# EAGLE design main (EAGLE 8.2.2)
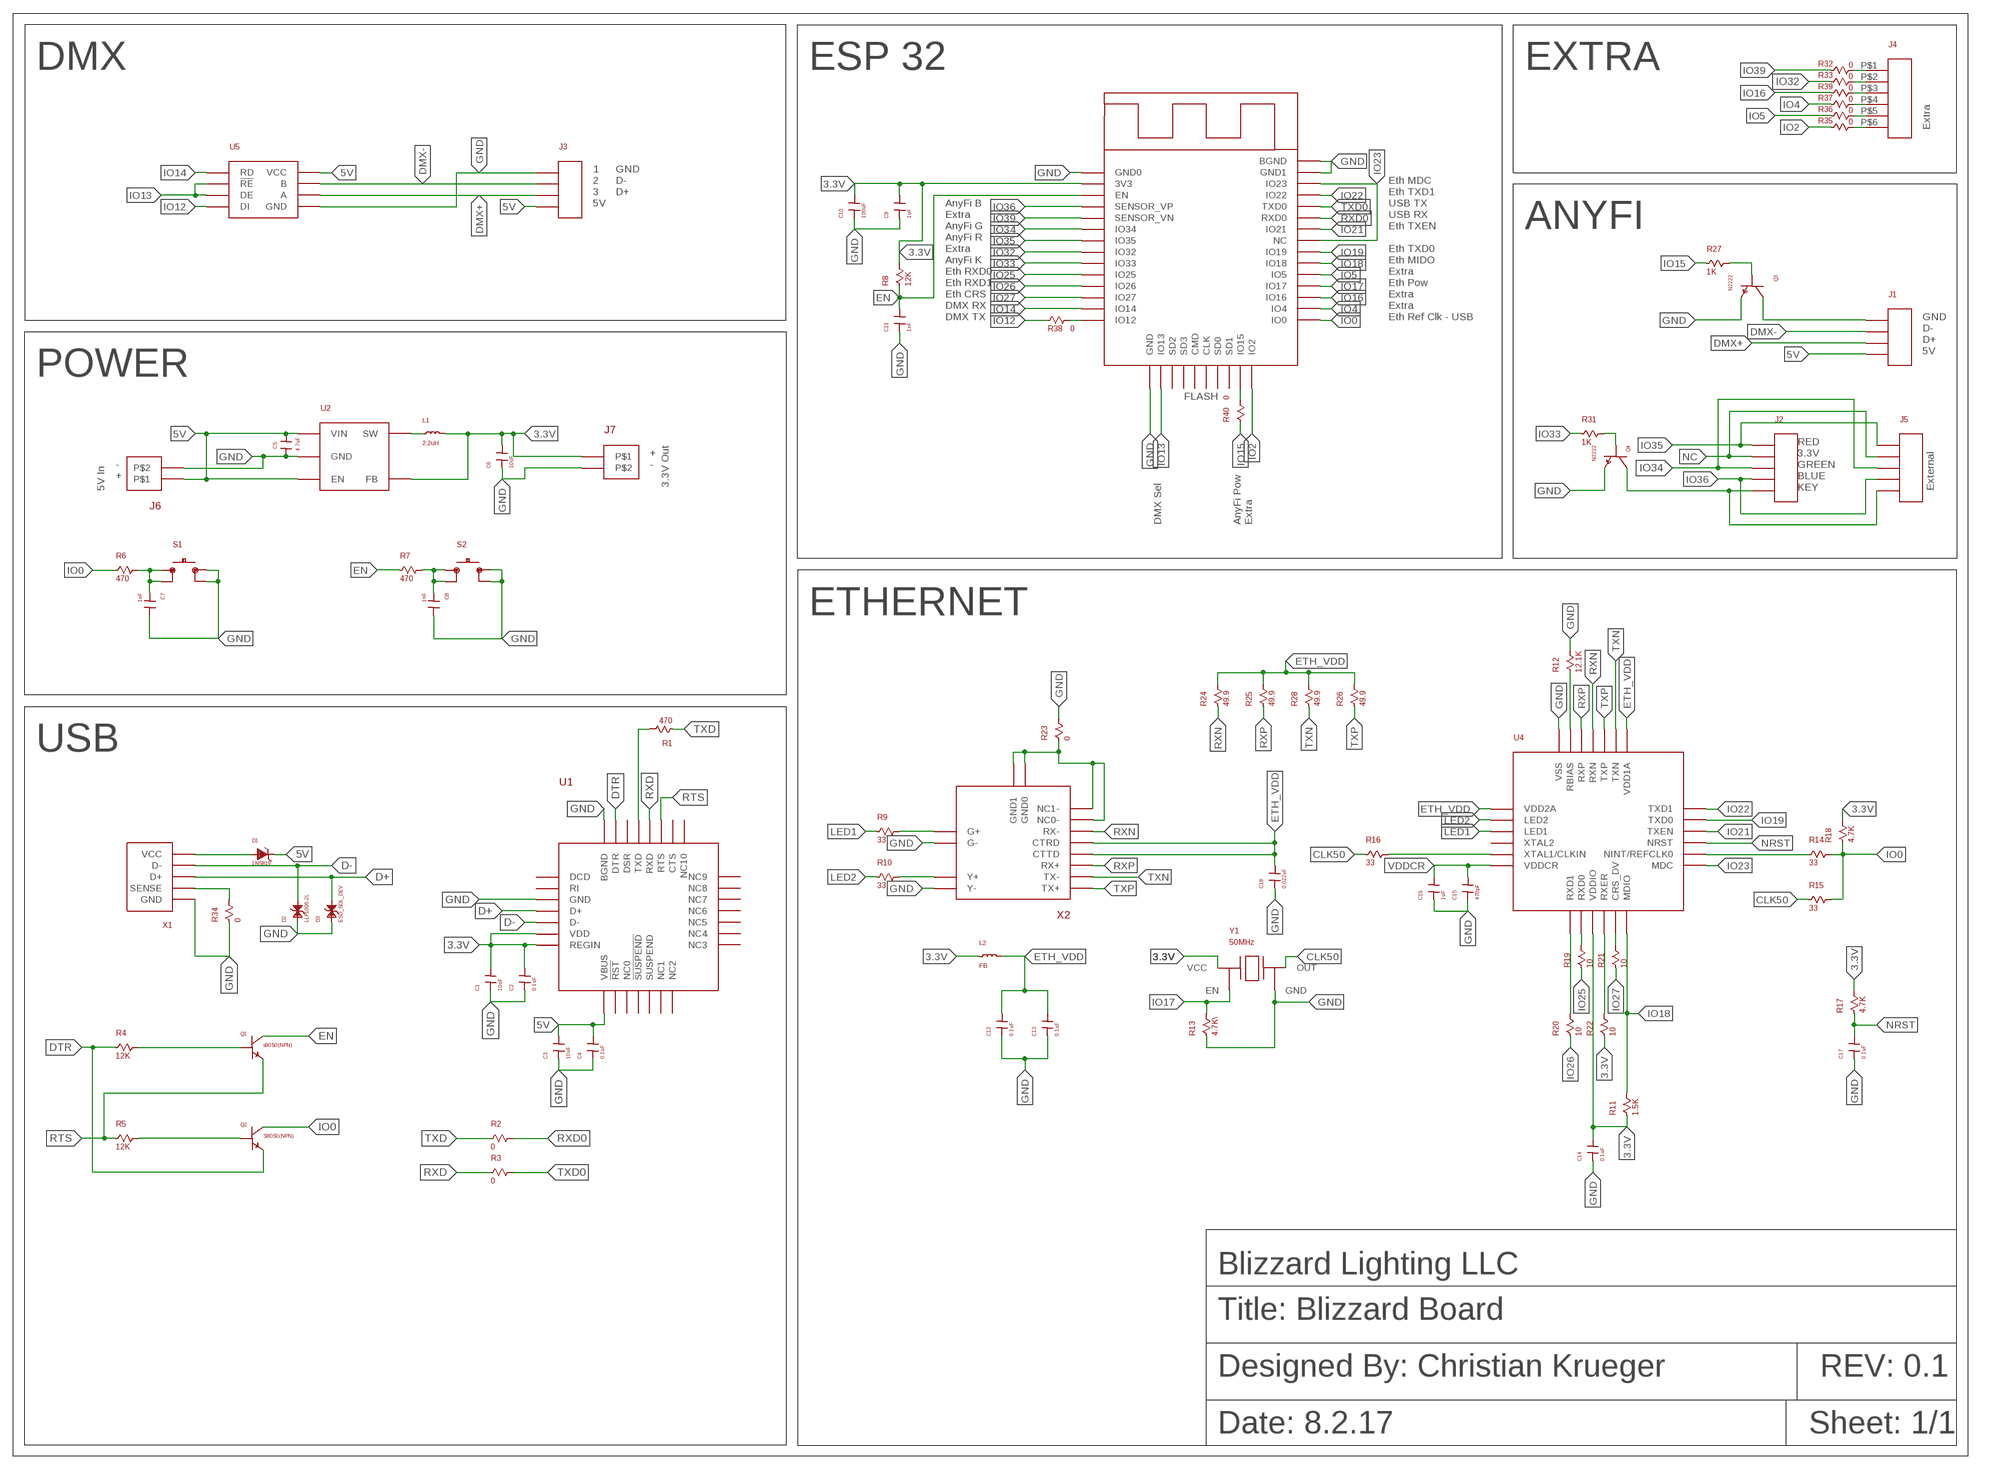
[diagram p0: schematic, sheet 1]

## Parts
C1  10uF  0805_CAP_DEV  [0805_PKG]
C2  0.1uF  0805_CAP_DEV  [0805_PKG]
C3  10uF  0805_CAP_DEV  [0805_PKG]
C4  0.1uF  0805_CAP_DEV  [0805_PKG]
C5  4.7uF  0805_CAP_DEV  [0805_PKG]
C6  10uF  0805_CAP_DEV  [0805_PKG]
C7  1nF  0805_CAP_DEV  [0805_PKG]
C8  1nF  0805_CAP_DEV  [0805_PKG]
C9  1uF  0805_CAP_DEV  [0805_PKG]
C10  100uF  0805_CAP_DEV  [0805_PKG]
C11  1nF  0805_CAP_DEV  [0805_PKG]
C12  0.1uF  0805_CAP_DEV  [0805_PKG]
C13  0.1uF  0805_CAP_DEV  [0805_PKG]
C14  0.1uF  0805_CAP_DEV  [0805_PKG]
C15  470pF  0805_CAP_DEV  [0805_PKG]
C16  1uF  0805_CAP_DEV  [0805_PKG]
C17  0.1uF  0805_CAP_DEV  [0805_PKG]
C18  0.022uF  0805_CAP_DEV  [0805_PKG]
D1  1N5819  ZENER_DEV  [ZENER_PKG]
D2  LLP1006-2L  ESD_SOL_DEV  [ESD_SOL_PKG]
D3  ESD_SOL_DEV  [ESD_SOL_PKG]
J1  XH_4POS_DEV  [XH_4POS_PKG]
J2  XH_5POS_DEV  [XH_5POS_PKG]
J3  XH_4POS_DEV  [XH_4POS_PKG]
J4  XH_6POS_DEV  [XH_6POS_PKG]
J5  XH_5POS_DEV  [XH_5POS_PKG]
J6  XH_2POS_DEV  [XH_2POS_PKG]
J7  XH_2POS_DEV  [XH_2POS_PKG]
L1  2.2uH  0805_IND_DEV  [0805_PKG]
L2  FB  0805_IND_DEV  [0805_PKG]
Q1  s8050(NPN)  NPN_1.5A_40V_DEV  [SOT_23_3_PKG]
Q2  S8050(NPN)  NPN_1.5A_40V_DEV  [SOT_23_3_PKG]
Q3  N2222  NPN_N2222_DEV  [SOT_23_3_PKG]
Q4  N2222  NPN_N2222_DEV  [SOT_23_3_PKG]
R1  470  0805_RES_DEV  [0805_PKG]
R2  0  0805_RES_DEV  [0805_PKG]
R3  0  0805_RES_DEV  [0805_PKG]
R4  12K  0805_RES_DEV  [0805_PKG]
R5  12K  0805_RES_DEV  [0805_PKG]
R6  470  0805_RES_DEV  [0805_PKG]
R7  470  0805_RES_DEV  [0805_PKG]
R8  12K  0805_RES_DEV  [0805_PKG]
R9  33  0805_RES_DEV  [0805_PKG]
R10  33  0805_RES_DEV  [0805_PKG]
R11  1.5K  0805_RES_DEV  [0805_PKG]
R12  12.1K  0805_RES_DEV  [0805_PKG]
R13  4.7K\  0805_RES_DEV  [0805_PKG]
R14  33  0805_RES_DEV  [0805_PKG]
R15  33  0805_RES_DEV  [0805_PKG]
R16  33  0805_RES_DEV  [0805_PKG]
R17  4.7K  0805_RES_DEV  [0805_PKG]
R18  4.7K  0805_RES_DEV  [0805_PKG]
R19  10  0805_RES_DEV  [0805_PKG]
R20  10  0805_RES_DEV  [0805_PKG]
R21  10  0805_RES_DEV  [0805_PKG]
R22  10  0805_RES_DEV  [0805_PKG]
R23  0  0805_RES_DEV  [0805_PKG]
R24  49.9  0805_RES_DEV  [0805_PKG]
R25  49.9  0805_RES_DEV  [0805_PKG]
R26  49.9  0805_RES_DEV  [0805_PKG]
R27  1K  0805_RES_DEV  [0805_PKG]
R28  49.9  0805_RES_DEV  [0805_PKG]
R31  1K  0805_RES_DEV  [0805_PKG]
R32  0  0805_RES_DEV  [0805_PKG]
R33  0  0805_RES_DEV  [0805_PKG]
R34  0  0805_RES_DEV  [0805_PKG]
R35  0  0805_RES_DEV  [0805_PKG]
R36  0  0805_RES_DEV  [0805_PKG]
R37  0  0805_RES_DEV  [0805_PKG]
R38  0  0805_RES_DEV  [0805_PKG]
R39  0  0805_RES_DEV  [0805_PKG]
R40  0  0805_RES_DEV  [0805_PKG]
S1  TACTILE_PB_DEV  [TACKTILE_PB_PKG]
S2  TACTILE_PB_DEV  [TACKTILE_PB_PKG]
U1  USB_TO_UART_DEV  [QFN_28_PKG]
U2  BUCK_CONVERTER_DEV  [SOT_23_PKG]
U3  ESP_WROOM_32_DEV  [ESP_WROOM_32_PKG]
U4  LAN8720_DEV  [QFN_24_PKG]
U5  MAX_485_DEV  [MAX_485_PKG]
X1  USB_CONN_DEV  [USB_CONN_PKG]
X2  ETHERNET_DEV  [ETHERNET_PKG]
Y1  50MHz  OSC_DEV  [OSC_PKG]

## Nets
3.3V: C1.P$2 C2.P$2 C6.P$2 C9.P$2 C10.P$2 C14.P$2 J7.P$1 L1.P$2 L2.P$1 R8.P$2 R11.P$1 R17.P$2 R18.P$2 R22.P$1 U1.REGIN U1.VDD U2.4(FB) U3.3V3 U4.9(VDDIO) Y1.4(VCC)
5V: C3.P$2 C4.P$2 C5.P$2 D1.P$2 J1.P$4 J3.P$4 J6.P$1 U1.VBUS U2.1(VIN) U2.3(EN) U5.P$8(VCC)
CLK50: R15.P$1 R16.P$1 Y1.3(OUT)
D+: D3.P$2 U1.D+ X1.PIN3(D+)
D-: D2.P$2 U1.D- X1.PIN2(D-)
DMX+: J1.P$3 J3.P$3 U5.P$6(A)
DMX-: J1.P$2 J3.P$2 U5.P$7(B)
DTR: Q2.P$2(E) R4.P$1 U1.DTR
EN: C11.P$2 Q1.P$3(C) R7.P$1 R8.P$1 U3.EN
ETH_VDD: C12.P$2 C13.P$2 C18.P$2 L2.P$2 R24.P$2 R25.P$2 R26.P$2 R28.P$2 U4.1(VDD2A) U4.19(VDD1A) X2.4(CTTD) X2.5(CTRD)
GND: C1.P$1 C2.P$1 C3.P$1 C4.P$1 C5.P$1 C6.P$1 C7.P$2 C8.P$2 C9.P$1 C10.P$1 C11.P$1 C12.P$1 C13.P$1 C14.P$1 C15.P$1 C16.P$1 C17.P$1 C18.P$1 D2.P$1 D3.P$1 J3.P$1 J6.P$2 J7.P$2 Q3.P$2(E) Q4.P$2(E) R12.P$2 R13.P$1 R23.P$2 R34.P$2 S1.3 S1.4 S2.3 S2.4 U1.BGND U1.GND U2.2(GND) U3.BGND U3.GND0(GND) U3.GND1(GND0) U3.GND2(GND1) U4.BGND(VSS) U5.P$5(GND) X1.PIN4(SENSE) X2.G- X2.Y- Y1.2(GND)
IO0: Q2.P$3(C) R6.P$1 R14.P$2 R15.P$2 R18.P$1 U3.IO0
IO2: R35.P$1 U3.IO2
IO4: R37.P$1 U3.IO4
IO5: R36.P$1 U3.IO5
IO12: R38.P$1 U5.P$4(DI)
IO13: U3.IO13 U5.P$2(!RE) U5.P$3(DE)
IO14: U3.IO14 U5.P$1(RD)
IO15: R27.P$1 R40.P$1
IO16: R39.P$1 U3.IO16
IO17: R13.P$2 U3.IO17 Y1.1(EN)
IO18: R11.P$2 U3.IO18 U4.12(MDIO)
IO19: U3.IO19 U4.17(TXD0)
IO21: U3.IO21 U4.16(TXEN)
IO22: U3.IO22 U4.18(TXD1)
IO23: U3.IO23 U3.NC U4.13(MDC)
IO25: R19.P$1 U3.IO25
IO26: R20.P$1 U3.IO26
IO27: R21.P$1 U3.IO27
IO32: R33.P$1 U3.IO32
IO33: R31.P$1 U3.IO33
IO34: J2.P$3 J5.P$3 U3.IO34
IO35: J2.P$1 J5.P$1 U3.IO35
IO36: J2.P$4 J5.P$4 U3.SENSOR_VP
IO39: R32.P$1 U3.SENSOR_VN
LED1: R9.P$1 U4.3(LED1)
LED2: R10.P$1 U4.2(LED2)
N$1: J4.P$1 R32.P$2
N$2: J4.P$2 R33.P$2
N$3: R1.P$2 U1.TXD
N$4: D1.P$1 X1.PIN1(VCC)
N$5: Q1.P$1(B) R4.P$2
N$6: Q2.P$1(B) R5.P$2
N$7: L1.P$1 U2.5(SW)
N$8: R34.P$1 X1.PIN5(GND)
N$9: J4.P$3 R39.P$2
N$10: J4.P$4 R37.P$2
N$11: J4.P$5 R36.P$2
N$12: J4.P$6 R35.P$2
N$13: R38.P$2 U3.IO12
N$14: R40.P$2 U3.IO15
N$24: R9.P$2 X2.G+
N$25: C7.P$1 R6.P$2 S1.1 S1.2
N$26: R22.P$2 U4.10(RXER)
N$28: R10.P$2 X2.Y+
N$29: C8.P$1 R7.P$2 S2.1 S2.2
N$30: R12.P$1 U4.24(RBIAS)
N$32: R16.P$2 U4.5(XTAL1/CLKIN)
N$33: R14.P$1 U4.14(NINT/REFCLK0)
N$34: R20.P$2 U4.7(RXD1)
N$35: R19.P$2 U4.8(RXD0)
N$36: R21.P$2 U4.11(CRS_DV)
N$37: R23.P$1 X2.7(NC0-) X2.8(NC1-) X2.GND0 X2.GND1
N$38: J1.P$1 Q3.P$3(C)
N$41: J2.P$5 J5.P$5 Q4.P$3(C)
N$42: Q4.P$1(B) R31.P$2
N$53: Q3.P$1(B) R27.P$2
NC: J2.P$2 J5.P$2
NRST: C17.P$2 R17.P$1 U4.15(NRST)
RTS: Q1.P$2(E) R5.P$1 U1.RTS
RXD: R3.P$1 U1.RXD
RXD0: R2.P$2 U3.RXD0
RXN: R24.P$1 U4.22(RXN) X2.6(RX-)
RXP: R25.P$1 U4.23(RXP) X2.3(RX+)
TXD: R1.P$1 R2.P$1
TXD0: R3.P$2 U3.TXD0
TXN: R28.P$1 U4.20(TXN) X2.2(TX-)
TXP: R26.P$1 U4.21(TXP) X2.1(TX+)
VDDCR: C15.P$2 C16.P$2 U4.6(VDDCR)
Unconnected: U1.!RST U1.!SUSPEND U1.CTS U1.DCD U1.DSR U1.NC0 U1.NC1 U1.NC2 U1.NC3 U1.NC4 U1.NC5 U1.NC6 U1.NC7 U1.NC8 U1.NC9 U1.NC10 U1.RI U1.SUSPEND U3.CLK U3.CMD U3.SD0 U3.SD1 U3.SD2 U3.SD3 U4.4(XTAL2)

## Notes on the sheet
- DMX | ESP 32 | EXTRA
- Extra
- 1 | GND
- 2 | D- | Eth MDC
- 3 | D+ | Eth TXD1
- 5V | AnyFi B | USB TX
- Extra | USB RX
- AnyFi G | Eth TXEN | ANYFI
- AnyFi R
- Extra | Eth TXD0
- AnyFi K | Eth MIDO
- Eth RXD0 | Extra
- Eth RXD1 | Eth Pow
- Eth CRS | Extra
- DMX RX | Extra
- DMX TX | Eth Ref Clk - USB | GND
- D-
- D+
- 5V
- POWER
- FLASH
- 3.3V Out | RED
- + | 3.3V
- - | - | GREEN
- + | BLUE
- 5V In | KEY | External
- DMX Sel | AnyFi Pow | Extra
- ETHERNET
- USB
- Blizzard Lighting LLC
- Title: Blizzard Board
- Designed By: Christian Krueger | REV: 0.1
- Date: 8.2.17 | Sheet: 1/1

## Library data of the parts
C1-C18 = blizzard_common_1:0805_CAP_DEV
D1 = blizzard_common_1:ZENER_DEV
D2 D3 = blizzard_common_1:ESD_SOL_DEV
J1 J3 = blizzard_common_1:XH_4POS_DEV
J2 J5 = blizzard_common_1:XH_5POS_DEV
J4 = blizzard_common_1:XH_6POS_DEV
J6 J7 = blizzard_common_1:XH_2POS_DEV
L1 L2 = blizzard_common_1:0805_IND_DEV
Q1 Q2 = blizzard_common_0:NPN_1.5A_40V_DEV: • SOT-23 Plastic-Encapsulate Transistors • Capable of 0.3Watts(Tamb=25O C) of Power Dissipation. • Collector-current 1.5A • Collector-base Voltage 40V • Operating and storage junctio
Q3 Q4 = blizzard_common_0:NPN_N2222_DEV
R1-R28 R31-R40 = blizzard_common_1:0805_RES_DEV
S1 S2 = blizzard_common_1:TACTILE_PB_DEV
U1 = blizzard_board:USB_TO_UART_DEV: SINGLE-CHIP USB-TO-UART BRIDGE
U2 = blizzard_common_0:BUCK_CONVERTER_DEV: LM3671/-Q1 2-MHz, 600-mA Step-Down DC-DC Converter
U3 = blizzard_board:ESP_WROOM_32_DEV: ESP Wroom 32
U4 = blizzard_board:LAN8720_DEV: LAN8720A Ethernet
U5 = blizzard_board:MAX_485_DEV: MAX 485
X1 = blizzard_common_1:USB_CONN_DEV
X2 = blizzard_board:ETHERNET_DEV: Ethernet Jack
Y1 = blizzard_board:OSC_DEV

## Board
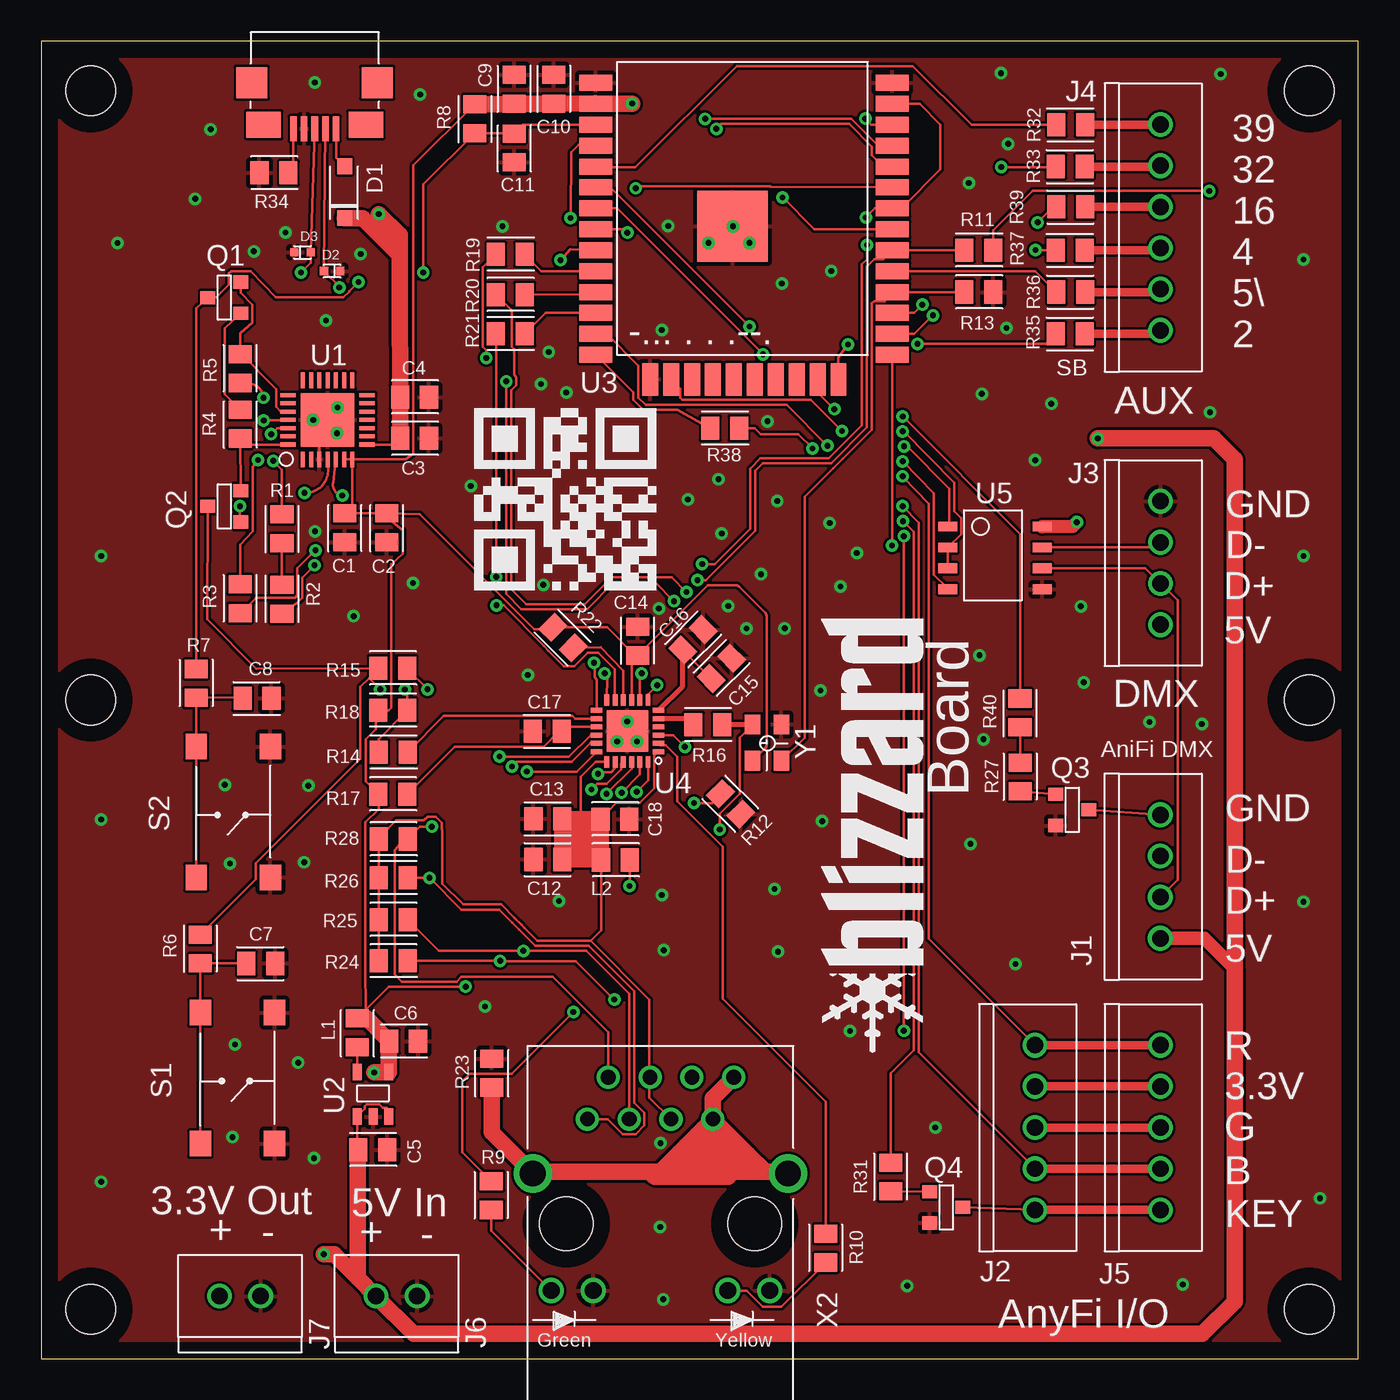
[diagram p1: board, top side]
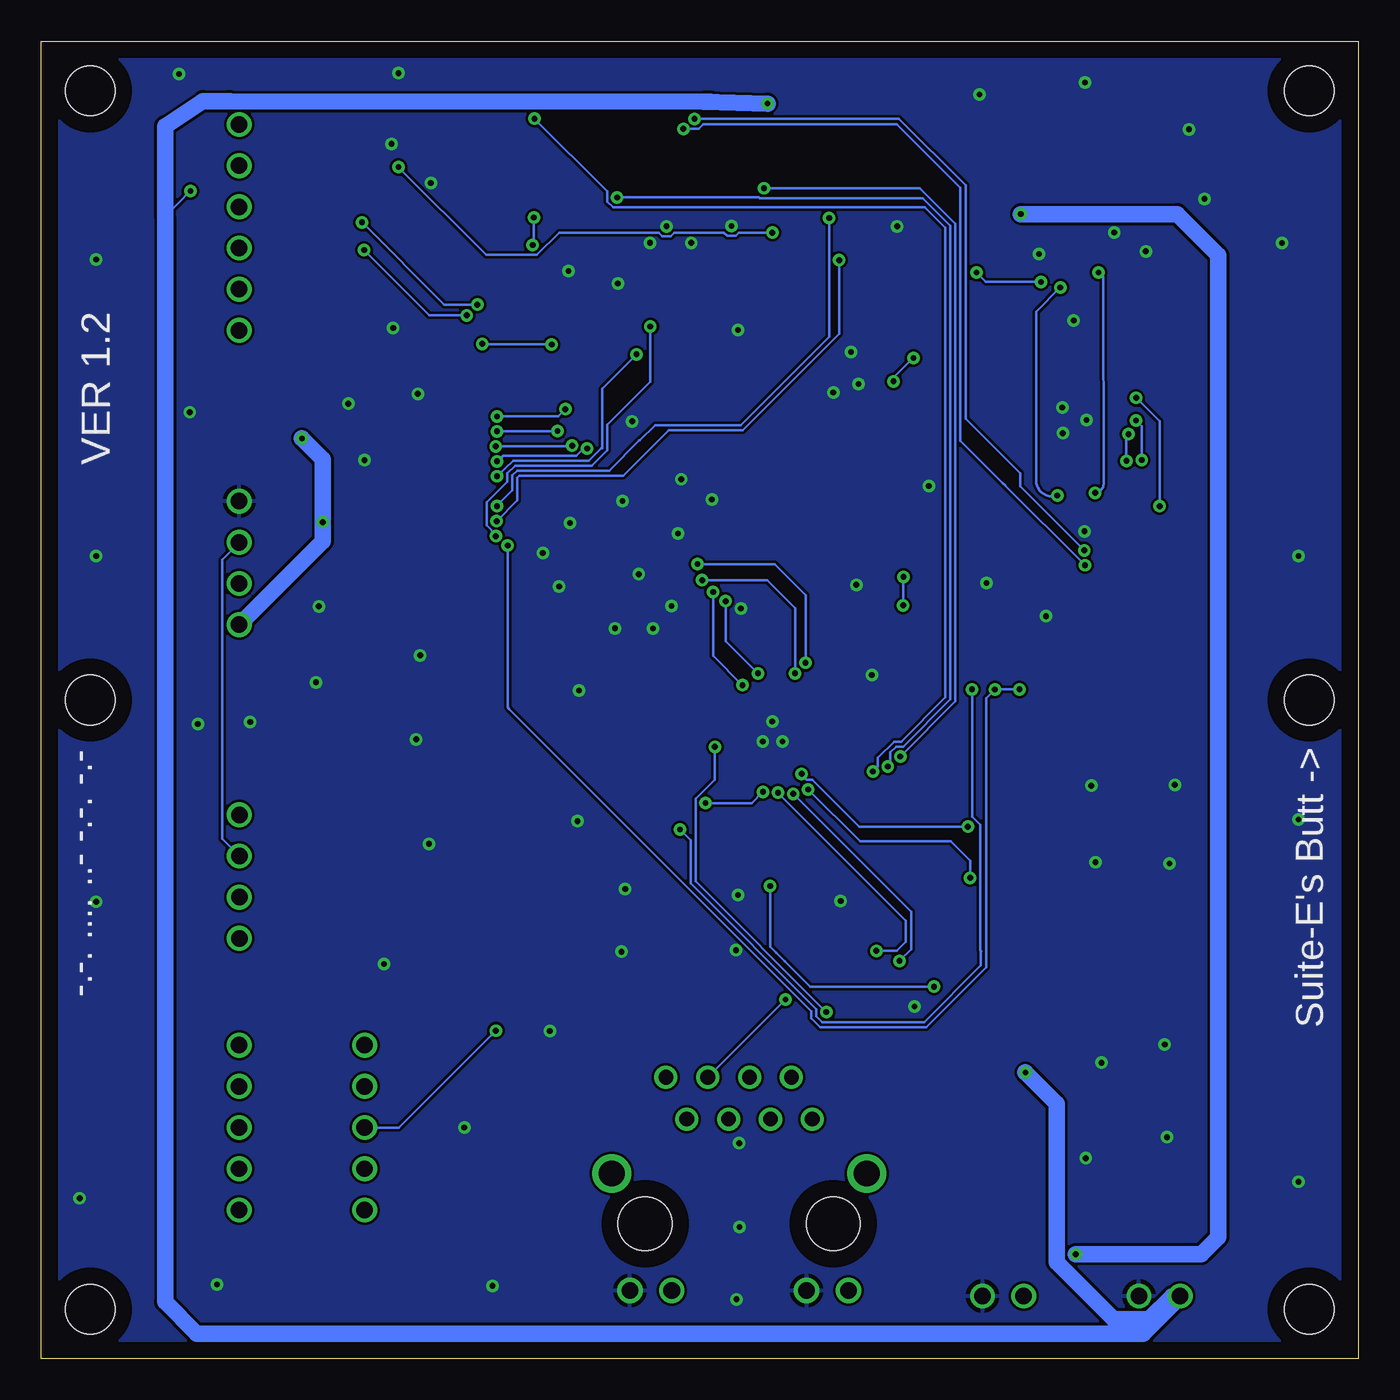
[diagram p2: board, bottom side, seen from below]

Size 79.98 x 80 mm. Coordinates in mm from the lower left corner, seen from the top.
Outline: 0,0 79.98,0 79.98,80 0,80 0,0
Copper layers (1*16): Top 0.035mm / dielectric 1.5mm / Bottom 0.035mm
Design rules "default": minimum track width 6mil, minimum drill 0.35mm, track to track 6mil, track to pad 6mil, pad to pad 6mil, via to via 6mil, smd to smd 6mil, copper to edge 40mil, drill to drill 6mil, minimum pad ring 10mil, minimum via ring 8mil, stop-mask expansion 4mil, vias tented up to drill 0mil, thermal gap 10mil
Holes 3 mm at 3,77 77,77 77,3 3,3 3,40 77,40

### Footprints (pad centres in the part's own frame; a part is rotated, then mirrored left to right if it is on the bottom)
0805_PKG = smd 1.1 x 1.4: P$1 -0.875,0; P$2 0.875,0
ZENER_PKG = smd 0.95 x 0.9: P$1 -1.575,0; P$2 1.575,0
ESD_SOL_PKG = smd 0.5 x 0.5: P$1 -0.5,0; P$2 0.5,0
XH_4POS_PKG = drill 1: P$1 -3.75,0; P$2 -1.25,0; P$3 1.25,0; P$4 3.75,0
XH_5POS_PKG = drill 1: P$1 -5,0; P$2 -2.5,0; P$3 0,0; P$4 2.5,0; P$5 5,0
XH_6POS_PKG = drill 1: P$1 -6.25,0; P$2 -3.75,0; P$3 -1.25,0; P$4 1.25,0; P$5 3.75,0; P$6 6.25,0
XH_2POS_PKG = drill 1: P$1 -1.27,0; P$2 1.23,0
SOT_23_3_PKG = smd 0.8 x 0.9: P$1 -0.95,-1.001; P$2 0.95,-1.001; P$3 0,0.999
TACKTILE_PB_PKG = smd 1.55 x 1.3: 1 -3.975,2.25; 2 3.975,2.25; 3 -3.975,-2.25; 4 3.975,-2.25
QFN_28_PKG = smd 0.25 x 0.95: !RST -1,-2.401; !SUSPEND 0,-2.401; CTS 1,2.399; DSR -1,2.399; DTR -1.5,2.399; NC0 -0.5,-2.401; NC1 1,-2.401; NC2 1.5,-2.401; NC10 1.5,2.399; RTS 0.5,2.399; RXD 0,2.399; SUSPEND 0.5,-2.401; TXD -0.5,2.399; VBUS -1.5,-2.401 | smd 3.25 x 3.25: BGND 0,-0.001 | smd 0.95 x 0.25: D+ -2.4,-0.001; D- -2.4,-0.501; DCD -2.4,1.499; GND -2.4,0.499; NC3 2.4,-1.501; NC4 2.4,-1.001; NC5 2.4,-0.501; NC6 2.4,-0.001; NC7 2.4,0.499; NC8 2.4,0.999; NC9 2.4,1.499; REGIN -2.4,-1.501; RI -2.4,0.999; VDD -2.4,-1.001
SOT_23_PKG = smd 0.55 x 1: 1 -0.95,-1.35; 2 0,-1.35; 3 0.95,-1.35; 4 0.95,1.35; 5 -0.95,1.35
ESP_WROOM_32_PKG = smd 2 x 0.97: 3V3 -8.992,6.35; EN -8.992,5.08; GND0 -8.992,7.62; GND2 9.008,7.62; IO0 9.008,-8.89; IO4 9.008,-7.62; IO5 9.008,-3.81; IO12 -8.992,-8.89; IO14 -8.992,-7.62; IO16 9.008,-6.35; IO17 9.008,-5.08; IO18 9.008,-2.54; IO19 9.008,-1.27; IO21 9.008,1.27; IO22 9.008,5.08; IO23 9.008,6.35; IO25 -8.992,-3.81; IO26 -8.992,-5.08; IO27 -8.992,-6.35; IO32 -8.992,-1.27; IO33 -8.992,-2.54; IO34 -8.992,1.27; IO35 -8.992,0; NC 9.008,0; RXD0 9.008,2.54; SENSOR_VN -8.992,2.54; SENSOR_VP -8.992,3.81; TXD0 9.008,3.81 | smd 4.3 x 4.3: BGND -0.692,-1.09 | smd 0.97 x 2: CLK 0.658,-10.39; CMD -0.612,-10.39; GND1 -5.692,-10.39; IO2 5.738,-10.39; IO13 -4.422,-10.39; IO15 4.468,-10.39; SD0 1.928,-10.39; SD1 3.198,-10.39; SD2 -3.152,-10.39; SD3 -1.882,-10.39
QFN_24_PKG = smd 0.7 x 0.3: 1 -1.88,1.243; 2 -1.88,0.743; 3 -1.88,0.243; 4 -1.88,-0.257; 5 -1.88,-0.757; 6 -1.88,-1.257; 13 1.87,-1.257; 14 1.87,-0.757; 15 1.87,-0.257; 16 1.87,0.243; 17 1.87,0.743; 18 1.87,1.243 | smd 0.3 x 0.7: 7 -1.255,-1.882; 8 -0.755,-1.882; 9 -0.255,-1.882; 10 0.245,-1.882; 11 0.745,-1.882; 12 1.245,-1.882; 19 1.245,1.868; 20 0.745,1.868; 21 0.245,1.868; 22 -0.255,1.868; 23 -0.755,1.868; 24 -1.255,1.868 | smd 2.5 x 2.5: BGND -0.005,-0.007
MAX_485_PKG = smd 0.6 x 1.15: P$1 -1.905,-2.883; P$2 -0.635,-2.883; P$3 0.635,-2.883; P$4 1.905,-2.883; P$5 1.905,2.857; P$6 0.635,2.857; P$7 -0.635,2.857; P$8 -1.905,2.857
USB_CONN_PKG = smd 2.1 x 1.6: P$1 -3.1,2.55; P$2 3.1,2.55 | smd 1.9 x 1.9: P$3 -3.8,0; P$4 3.82,0 | smd 0.4 x 1.5: PIN1 -1.3,2.8; PIN2 -0.65,2.8; PIN3 0,2.8; PIN4 0.65,2.8; PIN5 1.3,2.8
ETHERNET_PKG = drill 0.89: 1 -4.44,6.345; 2 -3.17,8.885; 3 -1.9,6.345; 4 -0.63,8.885; 5 0.64,6.345; 6 1.91,8.885; 7 3.18,6.345; 8 4.45,8.885 | drill 1.02: G+ -6.63,-4.065; G- -4.09,-4.065; Y+ 4.09,-4.065; Y- 6.63,-4.065 | drill 1.57: GND0 -7.745,3.045; GND1 7.745,3.045 | hole 3.25: -5.715,-0.005; 5.715,-0.005
OSC_PKG = smd 1.2 x 0.95: 1 -1.105,-0.876; 2 1.095,-0.876; 3 1.095,0.874; 4 -1.105,0.874

### Placement (x,y rotation side)
C1  18.43,50.46 90 top
C2  20.97,50.46 90 top
C3  22.67,55.88 180 top
C4  22.67,58.39 180 top
C5  20.13,12.7 180 top
C6  22,19.27 180 top
C7  13.33,24 0 top
C8  13.11,40.1 0 top
C9  28.72,77.08 270 top
C10  31.13,77.08 270 top
C11  28.72,73.51 90 top
C12  30.77,30.32 0 top
C13  30.77,32.8 0 top
C14  36.21,43.58 270 top
C15  41.3,41.93 225 top
C16  39.57,43.66 225 top
C17  30.73,38.1 0 top
C18  34.84,32.77 180 top
D1  18.43,70.83 270 top
D2  17.67,66.04 180 top
D3  15.86,67.18 0 top
J1  67.95,29.28 270 top
J2  60.34,14.04 270 top
J3  67.96,48.32 270 top
J4  67.96,68.69 270 top
J5  67.96,14.04 270 top
J6  21.59,3.81 0 top
J7  12.1,3.81 0 top
L1  19.19,19.79 90 top
L2  34.87,30.29 180 top
Q1  11.12,64.43 90 top
Q2  11.12,51.76 90 top
Q3  62.6,33.33 270 top
Q4  54.95,9.2 270 top
R1  14.62,50.4 90 top
R2  14.62,46.12 270 top
R3  12.08,46.15 270 top
R4  12.08,56.75 90 top
R5  12.08,60.12 270 top
R6  9.67,24.88 270 top
R7  9.41,41.01 270 top
R8  26.33,75.29 90 top
R9  27.33,9.91 270 top
R10  47.64,6.72 270 top
R11  56.93,67.31 180 top
R12  41.86,33.69 315 top
R13  56.93,64.77 180 top
R14  21.37,36.83 180 top
R15  21.34,41.94 180 top
R16  40.47,38.5 180 top
R17  21.34,34.29 180 top
R18  21.34,39.37 180 top
R19  28.48,67.06 180 top
R20  28.48,64.61 180 top
R21  28.48,62.23 180 top
R22  31.68,43.79 315 top
R23  27.35,17.35 90 top
R24  21.37,24.16 180 top
R25  21.37,26.67 180 top
R26  21.37,29.21 180 top
R27  59.45,35.33 270 top
R28  21.37,31.56 180 top
R31  51.58,11.04 270 top
R32  62.51,74.93 0 top
R33  62.48,72.39 0 top
R34  14.13,72 180 top
R35  62.48,62.23 0 top
R36  62.51,64.77 0 top
R37  62.48,67.31 0 top
R38  41.5,56.5 180 top
R39  62.51,69.94 0 top
R40  59.43,39.22 90 top
S1  11.92,17.04 90 top
S2  11.66,33.2 90 top
U1  17.39,57.01 90 top
U2  20.15,16.05 0 top
U3  42.67,69.85 0 top
U4  35.59,38.11 180 top
U5  57.92,48.63 270 top
X1  16.61,77.48 180 top
X2  37.6,8.21 0 top
Y1  44.07,37.42 90 top

### Tracks (layer width: path | path; a pad name or v marks a point on that pad's centre or on a via)
3.3V  (via drill 0.35)
  Top 0.152: C2.P$2 20.97,51.1 21.96,50.3 21.96,48.88 21.27,48.26 21.27,39.54 21.1,39.37 | 21.1,39.37 20.32,38.59 20.32,38.23 19.71,37.62 19.71,35.07 R17.P$2 20.49,33.37 19.68,32.56 19.68,23.75 19.71,21.19 L1.P$2 21.11,22.59 v25.77,22.59 | C2.P$2 C1.P$2 18.89,51.74 U1.REGIN | U1.VDD U1.REGIN | U1.REGIN 19.23,54.62 22.14,54.62 22.59,54.96 22.59,72.46 R8.P$2 | 36.14,42.63 C14.P$2 40.48,46.97 42.15,46.97 arc-45 42.37,46.88 43.95,45.3 arc-45 44.04,45.08 44.04,37.29 arc-45 43.95,37.07 Y1.4 | 36.14,42.63 35.85,42.34 U4.9 | v35.72,28.7 35.73,28.71 L2.P$1 | C2.P$2 22.97,51.28 29.95,44.3 31.03,44.3 R22.P$1 34.36,44.41 36.14,42.63 | 21.1,39.37 R18.P$2 | v70.92,70.91 68.38,70.91 68.37,70.92 60.21,70.92 57.8,68.52 R11.P$1
  Top 1.016: v20.22,17.39 21.05,17.39 U2.4 21.09,19.27 C6.P$2 19.76,20.67 L1.P$2 | v35.88,76.21 v35.87,76.2 U3.3V3 33.64,76.23 C10.P$2 C9.P$2 28.66,76.17 R8.P$2
  Bottom 0.152: v35.72,28.7 35.72,25.03 35.34,24.65 34.84,24.15 33.28,22.59 v25.77,22.59 | 72.46,69.34 v70.92,70.91
  Bottom 1.016: v20.22,17.39 18.33,15.5 18.33,5.87 14.86,2.4 12.72,2.4 11.31,3.81 J7.P$1 10.81,3.78 13.07,1.52 70.52,1.52 72.46,3.46 72.46,69.34 72.46,74.84 70.17,76.36 68.49,76.35 68.55,76.36 39.31,76.32 39.79,76.32 v35.88,76.21
5V  (via drill 0.35)
  Top 0.152: C5.P$2 19.19,12.73 U2.1 19.64,15.18 19.64,15.33 19.77,15.46 20.51,15.46 20.73,15.24 20.97,15.24 21.09,15.12 U2.3 | 19.22,4.92 | U1.VBUS 21.76,55.51 C3.P$2
  Top 0.813: v62.88,50.8 62.63,50.55 U5.P$8 | J1.P$4 70.62,25.52 72.46,23.69
  Top 1.016: 19.22,4.92 J6.P$1 22.62,1.52 70.5,1.52 72.46,3.48 72.46,23.69 72.46,54.61 71.19,55.88 v64.15,55.88 | 19.22,4.92 17.8,6.35 v17.16,6.35 | C5.P$2 19.22,12.7 19.22,4.92 | C4.P$2 C3.P$2 21.76,67 | v20.5,69.5 21.76,68.24 21.76,67 | 21.76,67 19.52,69.24 D1.P$2
  Bottom 1.016: v17.16,6.35 9.54,6.35 8.5,7.39 8.5,67 11,69.5 v20.5,69.5 | v64.15,55.88 62.88,54.61 v62.88,50.8 62.88,49.65 J3.P$4
CLK50  (via drill 0.35)
  Top 0.152: v41.2,32.14 41.2,33.1 42.4,34.3 42.4,37.72 Y1.3 | v23.46,40.65 22.24,41.87 R15.P$1
  Top 0.305: Y1.3 43.18,38.5 R16.P$1
  Bottom 0.152: v41.2,32.14 40.55,31.49 40.55,28.86 32.92,21.23 32.92,20.8 32.56,20.44 26.38,20.44 22.92,23.9 22.92,24.73 22.91,24.74 22.97,24.8 22.97,32.42 23.46,32.91 v23.46,40.65
D+  (via drill 0.35)
  Top 0.152: U1.D+ 17.42,53.89 arc-90 v15.99,52.58 | v15.78,65.96 16.38,66.56 D3.P$2 X1.PIN3
  Bottom 0.152: v15.99,52.58 16.05,52.59 arc-90 15.48,53.09 15.49,65.67 v15.78,65.96
D-  (via drill 0.35)
  Top 0.152: U1.D- 17.72,53.2 arc90 v18.28,52.42 | v18.1,65.05 18.1,65.12 D2.P$2 X1.PIN2
  Bottom 0.152: v18.28,52.42 18.59,52.36 arc90 19.57,53.34 19.57,63.58 v18.1,65.05
DMX+
  Top 0.152: U5.P$6 67.04,47.99 J3.P$3 67.98,47.07 69,46.05 69,29.08 J1.P$3
DMX-
  Top 0.152: U5.P$7 67.65,49.26 J3.P$2
  Bottom 0.152: J3.P$2 69,48.53 69,31.58 J1.P$2
DTR
  Top 0.152: Q2.P$2 R4.P$1 12.45,55.51 U1.DTR
EN  (via drill 0.35)
  Top 0.152: R7.P$1 9.41,51.24 9.4,51.26 9.4,63.77 Q1.P$3 10.63,64.45 11.4,65.22 11.4,65.89 11.54,66.03 12.71,66.03 14.24,64.44 18.35,64.44 18.71,64.8 18.71,64.82 v19.27,65.38 | v23.2,65.96 23.2,71.31 R8.P$1 28.69,74.42 C11.P$2 29.25,74.93 U3.EN
  Bottom 0.152: v19.27,65.38 22.62,65.38 v23.2,65.96
ETH_VDD
  Top 0.152: U4.19 33.67,36.24 32.77,35.34 | 32.77,35.34 32.76,35.34 32.77,35.35 32.77,35.34 | 32.77,35.34 32.77,33.05 C13.P$2 | U4.1 37.23,36.62 37.23,34.64 36.36,33.77 34.92,33.77 C18.P$2 | 28.74,26.77 27.93,27.58 25.63,27.58 24.36,28.85 24.36,32.13 24.33,32.16 24.33,32.56 23.97,32.92 23.47,32.92 23.24,32.69 22.86,32.7 21.57,32.7 20.64,31.77 R28.P$2 R26.P$2 R25.P$2 R24.P$2 | 28.74,26.77 29.16,26.34 | 28.74,26.77 28.82,26.68 29.34,26.17 30.13,25.38 33.36,25.38 | 28.74,26.77 | 33.36,25.38 36.93,21.8 36.93,17.13 | L2.P$2 33.99,26.01 33.36,25.38 | 36.93,17.13 X2.4 | X2.5 36.93,15.86 36.93,17.13
  Top 1.016: 33.98,31.39 33.98,32.77 C18.P$2 C13.P$2 | 32.55,31.35 C12.P$2 | 33.61,30.29 C12.P$2 | 33.61,30.29 L2.P$2 | L2.P$2 33.98,30.79 33.98,31.39 | 33.98,31.39 C13.P$2 | C13.P$2 32.55,31.91 | 32.55,31.91 32.55,31.35 | 32.55,31.35 33.61,30.29 | L2.P$2 33.98,30.47 32.55,31.91 | C12.P$2 C13.P$2
GND  (via drill 0.35)
  Top 0.152: U1.GND 16.89,57.01 U1.BGND
  other vias: 16.63,50.24 31.44,27.8 37.68,28.16 37.8,24.81 35.59,38.7 34.97,37.48 36.17,37.48 19.4,67.08 14.83,68.39 45.14,44.35 47.32,40.58 26.95,21.39 37.5,45.55 47.87,50.74 43.7,47.64 41.71,45.7 30.35,59.19 30.49,47 30.82,61.13 44.1,56.92 37.68,62.47 44.97,65.29 38.07,68.78 47.97,66.05 41.12,53.4 41.32,50.11 57.11,58.59 70.96,57.47 60.35,54.56 56.32,71.39 58.28,78.06 71.61,78.01 10.29,74.65 16.61,77.49 9.35,70.43 12.91,67.24 16.22,34.8 15.97,30.15 15.6,17.98 16.56,12.18 37.6,13.09 37.77,3.61 37.58,8.01 52.58,4.43 44.52,28.52 56.43,31.27 63.3,41.07 56.97,42.71 69.31,4.51 42.83,44.34 49.1,19.91 44.74,24.72 67.29,38.67 57.21,37.61 63.12,45.69 61.33,57.99 54.29,14.04 47.42,32.64 11.15,34.85 11.77,19.09 11.62,13.46 11.47,30.07 22.58,47.1 18.97,45.09 58.71,73.77 29.55,41.52 23.01,76.76 28.01,68.76 26.08,52.99 4.64,67.75 3.64,48.75 3.64,32.75 3.64,10.75 77.64,9.75 76.64,27.75 76.64,48.75 76.64,66.75 58.61,62.59 31.88,58.67 42.01,68.76 40.51,67.76 43.01,67.76 39.26,52.17 48.53,46.89 49.52,48.93 44.69,52.08 70.47,38.55 59.16,23.97 16.51,57.01 17.98,57.76 17.95,56.2 17.29,63.04
  pour Bottom: 0,0 0,80.01 80.04,80.01 80.04,0
  pour Top: 0,0 80.31,0 80.31,80.01 0,80.01
IO0  (via drill 0.35)
  Top 0.152: 19.9,41.32 19.38,40.8 19.38,36.44 13.03,30.09 13.03,29.12 R6.P$1 | 19.9,41.32 R15.P$2 13.07,41.91 10.08,44.9 Q2.P$3 | R14.P$2 20.49,37.62 R18.P$1 22.24,40.48 v22.08,40.64 | v20.58,40.65 19.9,41.32 | 51.67,51.49 51.67,51.08 | 51.67,51.49 U3.IO0 | v51.66,49.38 arc45 51.67,49.41 51.67,51.49
  Bottom 0.152: v20.58,40.65 v20.59,40.64 v22.08,40.64 22.61,40.12 22.61,23.79 26.25,20.14 32.69,20.14 33.22,20.67 33.22,21.1 51.57,39.45 arc45 51.66,39.67 v51.66,49.38
IO2  (via drill 0.35)
  Top 0.152: v53.2,61.62 61,61.62 R35.P$1 | v48.98,61.59 48.4,60.77 U3.IO2
  Bottom 0.152: v53.2,61.62 53.17,61.59 v48.98,61.59
IO4  (via drill 0.35)
  Top 0.152: U3.IO4 53.02,62.23 v54.14,63.36 | v60.37,67.32 61.6,67.32 R37.P$1
  Bottom 0.152: 55.63,63.36 v54.14,63.36 | 55.63,63.36 55.72,63.36 | v60.37,67.32 56.41,63.36 55.63,63.36
IO5
  Top 0.152: U3.IO5 60.34,66.04 R36.P$1
IO12  (via drill 0.35)
  Top 0.152: U5.P$4 55.01,46.81 54.2,47.61 54.2,52.57 v52.31,54.49 | R38.P$1 43.33,56.5 43.7,56.13 45.97,56.13 v46.83,55.28
  Bottom 0.152: v46.83,55.28 47.05,55.28 47.49,54.83 51.94,54.83 v52.31,54.49
IO13  (via drill 0.35)
  Top 0.152: U5.P$3 U5.P$2 55.87,50.05 55.87,51.03 55.45,51.45 55.45,53.19 52.36,56.31 v52.31,56.31 | v48.62,56.33 46.72,58.23 38.93,58.23 38.8,58.37 38.8,58.9 U3.IO13
  Bottom 0.152: v52.31,56.31 52.26,56.33 v48.62,56.33
IO14  (via drill 0.35)
  Top 0.152: U5.P$1 55.15,50.69 55.15,52.83 52.57,55.4 v52.38,55.4 | v47.74,55.44 45.25,57.93 36.7,57.93 36.26,58.37 36.26,60.3 34.33,62.23 U3.IO14
  Bottom 0.152: 52.34,55.44 v52.38,55.4 47.78,55.4 v47.74,55.44
IO15
  Top 0.152: 59.94,36.68 R27.P$1 59.45,38.32 R40.P$1
IO16  (via drill 0.35)
  Top 0.152: U3.IO16 53,63.5 v53.5,64 | R39.P$1 61.35,69.85 v60.5,69
  Bottom 0.152: v53.5,64 55.5,64 v60.5,69
IO17
  Top 0.152: 51.77,64.77 U3.IO17 | 51.77,64.77 R13.P$2 | 51.77,64.77 51.22,64.21 50.58,64.21 50.44,64.08 50.44,56.42 48.66,54.64 | 48.66,54.64 48.08,54.06 | Y1.1 46.35,37.72 46.35,52.33 48.66,54.64
IO18  (via drill 0.35)
  Top 0.152: R11.P$2 U3.IO18 51.11,66.75 50.58,66.75 50.14,66.31 50.14,56.55 47.95,54.37 43.8,54.37 43.34,53.91 43.34,50.26 40.35,47.27 v39.85,47.27 | U4.12 34.35,41.48 v34.21,41.62
  Bottom 0.152: v39.85,47.27 35.89,47.27 34.2,45.58 34.2,41.63 v34.21,41.62
IO19  (via drill 0.35)
  Top 0.152: U4.17 33.34,37.37 32.23,36.26 28.88,36.26 v28.58,35.96 | v45.01,70.51 46.94,68.58 U3.IO19
  Bottom 0.152: v28.58,35.96 28.43,36.11 28.43,36.82 28.07,37.17 27.64,37.17 24.77,40.04 24.77,56 | 24.77,56 | 24.77,56 24.77,68.78 26.45,70.46 36.35,70.46 36.4,70.51 v45.01,70.51
IO21  (via drill 0.35)
  Top 0.152: U4.16 33.7,37.87 33.38,37.87 32.04,36.56 v27.82,36.56 | 36.17,71.14 v36.1,71.07 36.22,71.19 44.25,71.19 44.27,71.17 U3.IO21
  Bottom 0.152: 24.47,55.87 | 24.47,55.87 24.47,68.91 26.63,71.07 v36.1,71.07 | v27.82,36.56 24.47,39.91 24.47,55.87
IO22  (via drill 0.35)
  Top 0.152: U4.18 32.51,35.65 v29.49,35.65 | v50.03,75.29 50.4,74.93 U3.IO22
  Bottom 0.152: v29.49,35.65 29.19,35.95 29.19,36.49 28.2,37.48 27.77,37.48 25.08,40.17 25.08,56.12 | 25.08,56.12 | 25.08,56.12 25.08,68.66 26.33,69.91 45.26,69.91 45.62,70.26 45.62,70.88 v50.03,75.29
IO23  (via drill 0.35)
  Top 0.152: U3.IO23 53.34,76.2 54.6,74.94 54.6,72.21 52.32,69.93 U3.NC 50.62,69.85 v50.07,69.3 | U4.13 33.73,41.24 33.61,41.37 33.61,42.23 v33.57,42.26 | v50.14,67.63 50.14,66.75 49.83,66.44 49.83,56.67 47.83,54.67 43.67,54.67 43.04,54.04 43.04,50.39 40.9,48.25 v40.13,48.25
  Bottom 0.152: v33.57,42.26 33.57,46.37 35.45,48.25 v40.13,48.25 | v50.14,67.63 50.07,67.7 v50.07,69.3
IO25
  Top 0.152: R19.P$1 30.37,66.04 U3.IO25
IO26
  Top 0.152: U3.IO26 33.54,64.64 R20.P$1
IO27
  Top 0.152: R21.P$1 30.62,63.5 U3.IO27
IO32  (via drill 0.35)
  Top 0.152: U3.IO32 35.38,68.58 v35.59,68.38 | v58.29,72.36 61.58,72.36 R33.P$1
  Bottom 0.152: v35.59,68.38 37.62,68.38 37.82,68.17 38.32,68.17 38.52,68.38 41.54,68.38 41.76,68.15 42.26,68.15 42.48,68.38 48.53,68.38 49.89,67.02 52.95,67.02 v58.29,72.36
IO33  (via drill 0.35)
  Top 0.152: R31.P$1 51.58,17.33 52.98,18.73 52.98,50.2 v52.33,50.86 | v31.53,66.71 32.14,67.37 U3.IO33
  Bottom 0.152: v52.33,50.86 51.06,52.12 51.06,53.51 50.95,53.61 44.63,53.61 41.86,56.38 37.38,56.38 31.53,62.24 v31.53,66.71
IO34  (via drill 0.35)
  Top 0.152: U3.IO34 34.56,71.12 v43,62.68 | v52.38,49.95 v52.38,19.92
  Top 0.508: J5.P$3 J2.P$3
  Bottom 0.152: v43,62.68 43,59.33 45.62,56.71 45.62,55.15 46.54,54.22 51.21,54.22 51.67,53.76 51.67,53.26 52.93,52 52.93,50.61 52.38,50.05 v52.38,49.95 | v52.38,19.92 58.26,14.04 J2.P$3
IO35  (via drill 0.35)
  Top 0.152: J2.P$1 53.9,25.49 53.9,51.91 52.31,53.56 v52.31,53.58 | U3.IO35 34.97,69.85 v43.83,60.99
  Top 0.508: J5.P$1 J2.P$1
  Bottom 0.152: v52.31,53.58 51.33,54.53 46.72,54.53 45.97,55.28 45.92,55.28 45.92,58.9 v43.83,60.99
IO36  (via drill 0.35)
  Top 0.152: J2.P$4 53.29,18.6 53.29,50.76 v52.31,51.77 | U3.SENSOR_VP 33.17,73.7 32.63,73.7 32.17,73.27 v32.14,69.27
  Top 0.508: J5.P$4 J2.P$4
  Bottom 0.152: v52.31,51.77 52.28,51.82 51.37,52.73 51.37,53.63 51.08,53.92 45.5,53.92 43.66,55.76 43.62,55.76 42.69,56.69 37.51,56.69 32.14,62.06 v32.14,69.27
IO39
  Top 0.152: U3.SENSOR_VN 33.73,72.33 36.07,72.33 42.23,78.49 52.92,78.49 56.51,74.93 R32.P$1
LED1  (via drill 0.35)
  Top 0.152: v39.08,37.16 38.37,37.87 U4.3 | v32.31,21.05 28.57,17.31 26.58,17.31 | 26.58,17.31 26.4,17.31 | R9.P$1 25.56,12.55 25.56,16.86 26.01,17.31 26.58,17.31
  Bottom 0.152: v39.08,37.16 39.08,35.16 40.25,33.99 40.25,28.99 v32.31,21.05
LED2
  Top 0.152: R10.P$1 47.64,15.6 41.39,21.85 41.39,31.09 38.62,33.86 38.62,36.55 37.92,37.25 37.6,37.25 U4.2
N$1
  Top 0.508: R32.P$2 J4.P$1
N$2
  Top 0.508: J4.P$2 arc-90 67.92,72.39 R33.P$2
N$3  (via drill 0.35)
  Top 0.152: R1.P$2 14.62,53.99 v14.09,54.52 | v13.96,56.14 14.34,56.51 U1.TXD
  Bottom 0.152: v14.09,54.52 14.09,56.01 v13.96,56.14
N$4
  Top 0.152: D1.P$1 17.91,72.92 X1.PIN1
N$5
  Top 0.152: R4.P$2 11.15,58.56 11.15,62.57 Q1.P$1
N$6  (via drill 0.35)
  Top 0.152: Q2.P$1 12.07,50.81 v12.07,51.77 | v13.5,58.35 13.47,58.35 arc90 12.63,59.19 12.09,59.19 arc90 R5.P$2
  Bottom 0.152: v12.07,51.77 12.07,56.92 v13.5,58.35
N$7
  Top 0.152: L1.P$1 U2.5
N$8
  Top 0.152: R34.P$1 15.31,72.31 X1.PIN5
N$9
  Top 0.508: R39.P$2 J4.P$3
N$10
  Top 0.508: J4.P$4 arc-90 67.84,67.31 R37.P$2
N$11
  Top 0.508: J4.P$5 arc-90 67.8,64.77 R36.P$2
N$12
  Top 0.508: J4.P$6 arc-90 67.76,62.23 R35.P$2
N$13
  Top 0.152: R38.P$2 38.63,57.62 36.57,57.62 35.95,58.24 35.95,58.68 U3.IO12
N$14  (via drill 0.35)
  Top 0.152: R40.P$2 59.43,50.07 v52.31,57.22 | v48.15,57.65 47.13,58.68 U3.IO15
  Bottom 0.152: v52.31,57.22 48.59,57.22 v48.15,57.65
N$24
  Top 0.152: R9.P$2 27.33,7.79 X2.G+
N$25
  Top 0.152: S1.1 S1.2 R6.P$2 12.43,24.03 C7.P$1
N$26
  Top 0.152: R22.P$2 33.98,43.2 35.34,41.78 35.34,40.01 U4.10
N$28
  Top 0.152: X2.Y+ 42.83,4.14 43.82,3.15 44.95,3.15 R10.P$2
N$29
  Top 0.152: S2.1 S2.2 R7.P$2 12.18,40.16 C8.P$1
N$30  (via drill 0.35)
  Top 0.152: U4.24 36.85,35.12 v36.16,34.42 | v39.64,33.74 40.74,33.74 R12.P$1
  Bottom 0.152: v36.16,34.42 36.84,33.74 v39.64,33.74
N$32
  Top 0.305: R16.P$2 39.23,38.87 U4.5
N$33
  Top 0.152: U4.14 32.41,38.87 32.26,39.03 24.44,39.03 R14.P$1
N$34  (via drill 0.35)
  Top 0.152: R20.P$2 28.57,63.67 28.57,61.44 28.71,61.3 28.71,59.74 28.84,59.6 28.84,59.1 28.54,58.8 28.54,46.72 29.44,45.83 31.14,45.83 | v37.4,40.9 36.85,40.35 U4.7 | 31.14,45.83 | 31.14,45.83 33.02,45.83 34.63,47.45 38.29,47.45 v39.18,46.56
  Bottom 0.152: v39.18,46.56 39.18,42.68 v37.4,40.9
N$35  (via drill 0.35)
  Top 0.152: v27.02,60.77 27.02,61.24 26.82,61.44 26.82,66.28 R19.P$2 | v28.24,59.35 28.24,46.45 29.16,45.52 33.14,45.52 34.76,47.14 37.28,47.14 v38.42,46 | v36.46,41.62 36.35,41.51 U4.8
  Bottom 0.152: v27.02,60.77 28.24,59.56 v28.24,59.35 | v38.42,46 38.42,43.58 v36.46,41.62
N$36  (via drill 0.35)
  Top 0.152: R21.P$2 27.63,62.2 v27.63,47.48 | v27.65,45.75 28.07,45.75 30.52,43.3 30.79,43 31.73,42.06 32.29,42.06 32.37,42.06 33.17,42.87 33.82,42.87 34.82,41.87 34.82,40.03 U4.11
  Bottom 0.152: v27.63,47.48 27.65,47.46 v27.65,45.75
N$37
  Top 0.152: 27.39,16.44 R23.P$1
  Top 1.016: R23.P$1 27.35,13.76 X2.GND0 30.48,11.26 30.58,11.35 36.97,11.35 | 44.62,11.35 42.01,11.35 | 44.62,11.35 44.72,11.26 | 44.72,11.26 X2.GND1 44.72,11.26 | 36.97,11.35 37.26,11.06 | 37.26,11.06 37.98,11.06 | 39.66,11.06 37.98,11.06 | 39.66,11.06 41.72,11.06 42.01,11.35 | 44.72,11.26 44.62,11.35 | 44.62,11.35 43.98,11.35 42.9,12.43 | X2.7 42.9,12.43 | X2.7 40.78,15.82 X2.8 | 36.97,11.35 37.26,11.06 | 37.26,11.06 37.98,11.06 | 37.98,11.06 38.12,11.06 38.73,11.67 38.73,12.5 | 40.19,13.96 39.84,13.62 | 39.12,12.9 39.84,13.62 | 39.12,12.9 38.73,12.5 | 40.19,13.96 X2.7 | 36.97,11.35 37.58,11.35 38.73,12.5 | 37.98,11.06 39.66,11.06 | 39.66,11.06 41.53,11.06 41.88,11.42 | 41.88,11.42 42.9,12.43 | 42.9,12.43 41.71,12.43 40.19,13.96 | 39.84,13.62 39.84,13.46 41.88,11.42 | 42.01,11.35 40.67,11.35 39.12,12.9 | 38.73,12.5 38.73,12 39.66,11.06
N$38
  Top 0.152: J1.P$1 Q3.P$3
N$41
  Top 0.152: Q4.P$3 J2.P$5
  Top 0.508: J2.P$5 J5.P$5
N$42
  Top 0.152: Q4.P$1 R31.P$2
N$53
  Top 0.152: Q3.P$1 R27.P$2
NC
  Top 0.508: J5.P$2 J2.P$2
NRST
  Top 0.152: U4.15 31.88,38.37 C17.P$2 31.43,38.1 30.5,37.17 25.12,37.17 R17.P$1
RTS
  Top 0.152: U1.RTS 14.96,57.49 14.54,57.49 14.29,57.79 14.29,58.88 12.08,61.08 | R5.P$1 12.08,61.08 | 12.08,61.08 12.08,62.27 12.82,62.91 12.82,63.99 12.11,64.73 Q1.P$2
RXD  (via drill 0.35)
  Top 0.152: R3.P$1 12.08,49.42 12.85,50.24 12.85,54.17 v13.16,54.57 | v13.51,56.97 14.95,56.97 U1.RXD
  Bottom 0.152: v13.16,54.57 13.16,56.62 v13.51,56.97
RXD0  (via drill 0.35)
  Top 0.152: v16.6,48.18 15.85,47.44 15.85,46.22 15.54,45.91 R2.P$2 | v40.99,74.68 41.3,74.98 49.06,74.98 50.44,73.6 50.44,73.08 51.13,72.39 U3.RXD0
  Bottom 0.152: 21.59,53.17 21.46,53.04 | 21.59,53.17 24.16,55.75 24.16,71.11 28.02,74.97 39.77,74.97 40.06,74.68 v40.99,74.68 | v16.6,48.18 21.59,53.17
RXN  (via drill 0.35)
  Top 0.152: U4.22 35.85,35.84 v34.32,34.3 | R24.P$1 v27.87,24.16 27.89,24.14 32.47,24.14 v34.8,21.82
  Bottom 0.152: v34.32,34.3 27.16,27.15 27.16,24.87 v27.87,24.16 | X2.6 v34.8,21.81 v34.8,21.82
RXP  (via drill 0.35)
  Top 0.152: U4.23 36.35,35.48 v35.25,34.37 | R25.P$1 24.14,24.77 v29.27,24.77 33.11,24.77 35.7,22.18 X2.3
  Bottom 0.152: v35.25,34.37 27.48,26.61 27.48,25.32 28.03,24.77 v29.27,24.77
TXD
  Top 0.152: R2.P$1 R1.P$1
TXD0  (via drill 0.35)
  Top 0.152: R3.P$2 13.05,46.21 15.41,46.21 15.55,46.34 15.55,47.99 v16.65,49.09 | v40.31,75.29 49.18,75.29 50.81,73.66 U3.TXD0
  Bottom 0.152: v16.65,49.09 20.54,52.98 20.54,53.77 23.86,57.09 23.86,71.24 27.91,75.29 v40.31,75.29
TXN  (via drill 0.35)
  Top 0.152: U4.20 34.82,36.18 34.82,35.86 34.6,35.61 33.98,35.61 v33.8,35.52 | v23.72,32.31 23,32.31 R28.P$1 22.23,31.77 21.46,30.89 21.46,24.43 21.46,23.34 21.9,22.9 25.22,22.9 25.52,23.2 31.05,23.2 34.43,19.82 X2.2
  Bottom 0.152: v33.8,35.52 33.48,35.17 33.16,35.17 30.3,32.31 v23.72,32.31
TXP  (via drill 0.35)
  Top 0.152: v33.41,34.56 33.76,34.91 34.34,34.91 35.23,35.8 35.23,36.12 U4.21 | R26.P$1 v23.57,29.21 v23.58,29.2 25.5,27.28 27.8,27.28 28.61,26.47 | 28.61,26.47 29.04,26.04 | 28.61,26.47 30,25.07 33.23,25.07 36.01,22.3 36.01,15.56 36.63,14.94 36.63,14.17 36.08,13.63 35.32,13.63 34.39,14.55 X2.1
  Bottom 0.152: v23.58,29.2 23.58,30.24 24.75,31.41 30.26,31.41 v33.41,34.56
VDDCR
  Top 0.152: 40.61,41.59 C15.P$2 38.96,42.99 C16.P$2
  Top 0.305: U4.6 38.95,40.85 C16.P$2

### Text on the board
tPlace: 39 | 32 | 16 | 4 | 5\ | -... . . .--. | 2 | SB | AUX | GND | D- | D+ | 5V | DMX | AniFi DMX | Board | GND | D- | D+ | 5V | R | 3.3V | G | B | 3.3V Out | 5V In | KEY | + | - | + | - | AnyFi I/O
bPlace: VER 1.2 | Suite-E's Butt -> | -.-. .... ..- -.-. -.-